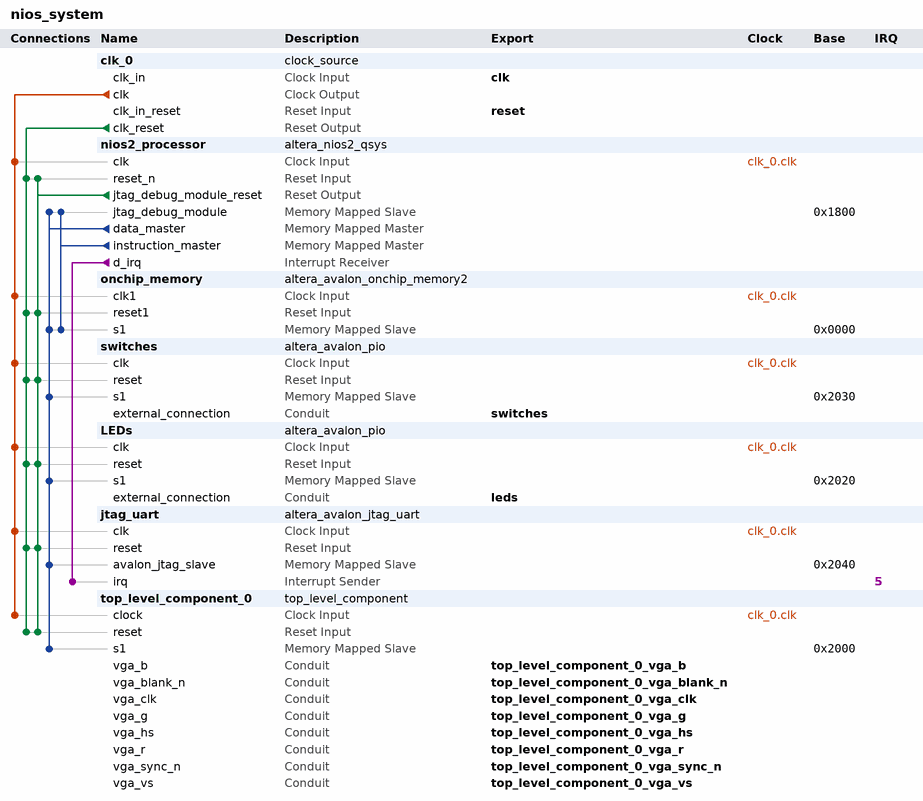
[diagram p0: system contents]
# Platform Designer (Qsys) system nios_system, Cyclone V 5CSEMA5F31C6
# Parameters at their usual value, and those the tool derives, are not listed.
package require -exact qsys 16.0
create_system nios_system
set_project_property DEVICE_FAMILY {Cyclone V}
set_project_property DEVICE 5CSEMA5F31C6

add_instance clk_0 clock_source 16.0
set_instance_parameter_value clk_0 clockFrequency 50000000

add_instance nios2_processor altera_nios2_qsys 16.0
set_instance_parameter_value nios2_processor breakSlave nios2_processor.jtag_debug_module
set_instance_parameter_value nios2_processor exceptionSlave onchip_memory.s1
set_instance_parameter_value nios2_processor icache_size 4096
set_instance_parameter_value nios2_processor impl Tiny
set_instance_parameter_value nios2_processor mmu_TLBMissExcSlave None
set_instance_parameter_value nios2_processor resetSlave onchip_memory.s1
set_instance_parameter_value nios2_processor resetrequest_enabled true

add_instance onchip_memory altera_avalon_onchip_memory2 16.0
set_instance_parameter_value onchip_memory dataWidth 32
set_instance_parameter_value onchip_memory dualPort false
set_instance_parameter_value onchip_memory initMemContent true
set_instance_parameter_value onchip_memory initializationFileName onchip_mem.hex
set_instance_parameter_value onchip_memory memorySize 4096

add_instance switches altera_avalon_pio 16.0
set_instance_parameter_value switches direction Input
set_instance_parameter_value switches width 8

add_instance LEDs altera_avalon_pio 16.0
set_instance_parameter_value LEDs direction Output
set_instance_parameter_value LEDs width 8

add_instance jtag_uart altera_avalon_jtag_uart 16.0
set_instance_parameter_value jtag_uart simInteractiveOptions NO_INTERACTIVE_WINDOWS

add_instance top_level_component_0 top_level_component 1.0

# connections
add_connection clk_0.clk jtag_uart.clk clock
add_connection clk_0.clk LEDs.clk clock
add_connection clk_0.clk nios2_processor.clk clock
add_connection clk_0.clk onchip_memory.clk1 clock
add_connection clk_0.clk switches.clk clock
add_connection clk_0.clk top_level_component_0.clock clock
add_connection clk_0.clk_reset jtag_uart.reset reset
add_connection clk_0.clk_reset LEDs.reset reset
add_connection clk_0.clk_reset nios2_processor.reset_n reset
add_connection clk_0.clk_reset onchip_memory.reset1 reset
add_connection clk_0.clk_reset switches.reset reset
add_connection clk_0.clk_reset top_level_component_0.reset reset
add_connection nios2_processor.jtag_debug_module_reset jtag_uart.reset reset
add_connection nios2_processor.jtag_debug_module_reset LEDs.reset reset
add_connection nios2_processor.jtag_debug_module_reset nios2_processor.reset_n reset
add_connection nios2_processor.jtag_debug_module_reset onchip_memory.reset1 reset
add_connection nios2_processor.jtag_debug_module_reset switches.reset reset
add_connection nios2_processor.jtag_debug_module_reset top_level_component_0.reset reset
add_connection nios2_processor.data_master jtag_uart.avalon_jtag_slave avalon
set_connection_parameter_value nios2_processor.data_master/jtag_uart.avalon_jtag_slave baseAddress 0x2040
add_connection nios2_processor.data_master LEDs.s1 avalon
set_connection_parameter_value nios2_processor.data_master/LEDs.s1 baseAddress 0x2020
add_connection nios2_processor.data_master nios2_processor.jtag_debug_module avalon
set_connection_parameter_value nios2_processor.data_master/nios2_processor.jtag_debug_module baseAddress 0x1800
add_connection nios2_processor.data_master onchip_memory.s1 avalon
set_connection_parameter_value nios2_processor.data_master/onchip_memory.s1 baseAddress 0x0000
add_connection nios2_processor.data_master switches.s1 avalon
set_connection_parameter_value nios2_processor.data_master/switches.s1 baseAddress 0x2030
add_connection nios2_processor.data_master top_level_component_0.s1 avalon
set_connection_parameter_value nios2_processor.data_master/top_level_component_0.s1 baseAddress 0x2000
add_connection nios2_processor.instruction_master nios2_processor.jtag_debug_module avalon
set_connection_parameter_value nios2_processor.instruction_master/nios2_processor.jtag_debug_module baseAddress 0x1800
add_connection nios2_processor.instruction_master onchip_memory.s1 avalon
set_connection_parameter_value nios2_processor.instruction_master/onchip_memory.s1 baseAddress 0x0000
add_connection nios2_processor.d_irq jtag_uart.irq interrupt
set_connection_parameter_value nios2_processor.d_irq/jtag_uart.irq irqNumber 5

# exported interfaces
add_interface clk clock sink
set_interface_property clk EXPORT_OF clk_0.clk_in
add_interface leds conduit end
set_interface_property leds EXPORT_OF LEDs.external_connection
add_interface reset reset sink
set_interface_property reset EXPORT_OF clk_0.clk_in_reset
add_interface switches conduit end
set_interface_property switches EXPORT_OF switches.external_connection
add_interface top_level_component_0_vga_b conduit end
set_interface_property top_level_component_0_vga_b EXPORT_OF top_level_component_0.vga_b
add_interface top_level_component_0_vga_blank_n conduit end
set_interface_property top_level_component_0_vga_blank_n EXPORT_OF top_level_component_0.vga_blank_n
add_interface top_level_component_0_vga_clk conduit end
set_interface_property top_level_component_0_vga_clk EXPORT_OF top_level_component_0.vga_clk
add_interface top_level_component_0_vga_g conduit end
set_interface_property top_level_component_0_vga_g EXPORT_OF top_level_component_0.vga_g
add_interface top_level_component_0_vga_hs conduit end
set_interface_property top_level_component_0_vga_hs EXPORT_OF top_level_component_0.vga_hs
add_interface top_level_component_0_vga_r conduit end
set_interface_property top_level_component_0_vga_r EXPORT_OF top_level_component_0.vga_r
add_interface top_level_component_0_vga_sync_n conduit end
set_interface_property top_level_component_0_vga_sync_n EXPORT_OF top_level_component_0.vga_sync_n
add_interface top_level_component_0_vga_vs conduit end
set_interface_property top_level_component_0_vga_vs EXPORT_OF top_level_component_0.vga_vs

set_interconnect_requirement {$system} qsys_mm.clockCrossingAdapter HANDSHAKE
set_interconnect_requirement {$system} qsys_mm.enableEccProtection FALSE
set_interconnect_requirement {$system} qsys_mm.insertDefaultSlave FALSE
set_interconnect_requirement {$system} qsys_mm.maxAdditionalLatency 1

save_system nios_system.qsys
